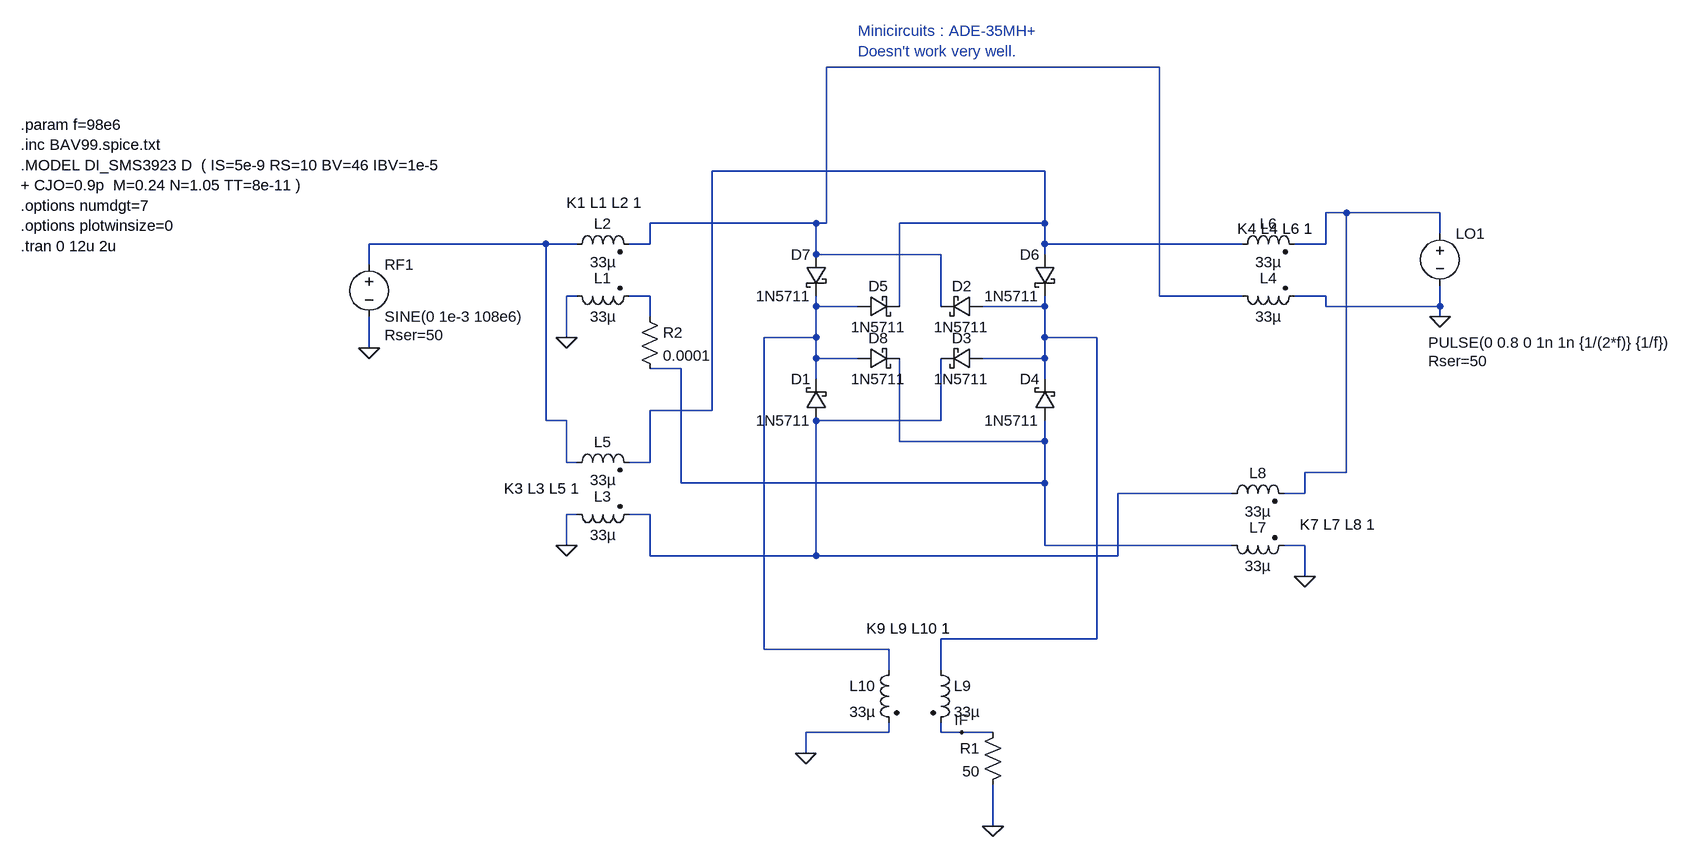
[diagram p0: schematic DDBM3.asc]
DDBM3.asc, the LTspice schematic file:
Version 4
SHEET 1 1816 884
WIRE 704 -304 192 -304
WIRE 528 -144 16 -144
WIRE 992 -80 960 -80
WIRE 1136 -80 992 -80
WIRE 176 -64 -80 -64
WIRE 192 -64 192 -304
WIRE 192 -64 176 -64
WIRE 528 -64 528 -144
WIRE 528 -64 304 -64
WIRE 1136 -48 1136 -80
WIRE -240 -32 -512 -32
WIRE -192 -32 -240 -32
WIRE -80 -32 -80 -64
WIRE -80 -32 -112 -32
WIRE 528 -32 528 -64
WIRE 832 -32 528 -32
WIRE 960 -32 960 -80
WIRE 960 -32 912 -32
WIRE 176 -16 176 -64
WIRE 368 -16 176 -16
WIRE 528 -16 528 -32
WIRE -512 0 -512 -32
WIRE -192 48 -208 48
WIRE -80 48 -112 48
WIRE 704 48 704 -304
WIRE 832 48 704 48
WIRE 960 48 912 48
WIRE 176 64 176 48
WIRE 240 64 176 64
WIRE 304 64 304 -64
WIRE 368 64 368 -16
WIRE 528 64 528 48
WIRE 528 64 432 64
WIRE 960 64 960 48
WIRE 1136 64 1136 32
WIRE 1136 64 960 64
WIRE -80 80 -80 48
WIRE 1136 80 1136 64
WIRE -208 112 -208 48
WIRE 176 112 176 64
WIRE 176 112 96 112
WIRE 528 112 528 64
WIRE 608 112 528 112
WIRE -512 128 -512 80
WIRE 176 144 176 112
WIRE 240 144 176 144
WIRE 528 144 528 112
WIRE 528 144 432 144
WIRE -32 160 -80 160
WIRE 176 176 176 144
WIRE 528 176 528 144
WIRE 16 224 16 -144
WIRE 16 224 -80 224
WIRE -240 240 -240 -32
WIRE -208 240 -240 240
WIRE 368 240 368 144
WIRE 368 240 176 240
WIRE 304 272 304 144
WIRE 528 272 528 240
WIRE 528 272 304 272
WIRE -208 304 -208 240
WIRE -192 304 -208 304
WIRE -80 304 -80 224
WIRE -80 304 -112 304
WIRE 992 320 992 -80
WIRE 992 320 928 320
WIRE -32 336 -32 160
WIRE 528 336 528 272
WIRE 528 336 -32 336
WIRE 816 352 640 352
WIRE 928 352 928 320
WIRE 928 352 896 352
WIRE -192 384 -208 384
WIRE -80 384 -112 384
WIRE -208 432 -208 384
WIRE 528 432 528 336
WIRE 816 432 528 432
WIRE 928 432 896 432
WIRE -80 448 -80 384
WIRE 176 448 176 240
WIRE 176 448 -80 448
WIRE 640 448 640 352
WIRE 640 448 176 448
WIRE 928 480 928 432
WIRE 608 576 608 112
WIRE 608 576 368 576
WIRE 96 592 96 112
WIRE 288 592 96 592
WIRE 288 624 288 592
WIRE 368 624 368 576
WIRE 288 720 288 704
WIRE 288 720 160 720
WIRE 368 720 368 704
WIRE 400 720 368 720
WIRE 448 720 400 720
WIRE 160 752 160 720
WIRE 448 864 448 800
FLAG -512 128 0
FLAG 1136 80 0
FLAG -208 112 0
FLAG -208 432 0
FLAG 160 752 0
FLAG 448 864 0
FLAG 928 480 0
FLAG 400 720 IF
SYMBOL voltage 1136 -64 R0
WINDOW 3 -18 184 Left 2
WINDOW 123 0 0 Left 0
WINDOW 39 -18 212 Left 2
SYMATTR Value PULSE(0 0.8 0 1n 1n {1/(2*f)} {1/f})
SYMATTR SpiceLine Rser=50
SYMATTR InstName LO1
SYMBOL ind2 -208 32 M90
WINDOW 0 4 56 VBottom 2
WINDOW 3 32 56 VTop 2
SYMATTR InstName L1
SYMATTR Value 33µ
SYMATTR Type ind
SYMATTR SpiceLine Rpar=0.0001
SYMBOL ind2 -208 -16 R270
WINDOW 0 32 56 VTop 2
WINDOW 3 4 56 VBottom 2
SYMATTR InstName L2
SYMATTR Value 33µ
SYMATTR Type ind
SYMBOL ind2 816 32 M90
WINDOW 0 4 56 VBottom 2
WINDOW 3 32 56 VTop 2
SYMATTR InstName L4
SYMATTR Value 33µ
SYMATTR Type ind
SYMATTR SpiceLine Rser=0.01
SYMBOL ind2 816 -16 R270
WINDOW 0 32 56 VTop 2
WINDOW 3 4 56 VBottom 2
SYMATTR InstName L6
SYMATTR Value 33µ
SYMATTR Type ind
SYMBOL schottky 192 240 R180
WINDOW 0 24 64 Left 2
WINDOW 3 24 0 Left 2
SYMATTR InstName D1
SYMATTR Value 1N5711
SYMATTR Description Diode
SYMATTR Type diode
SYMBOL voltage -512 -16 R0
WINDOW 123 0 0 Left 0
WINDOW 39 24 124 Left 2
SYMATTR SpiceLine Rser=50
SYMATTR InstName RF1
SYMATTR Value SINE(0 1e-3 108e6)
SYMBOL schottky 432 48 R90
WINDOW 0 0 32 VBottom 2
WINDOW 3 32 32 VTop 2
SYMATTR InstName D2
SYMATTR Value 1N5711
SYMATTR Description Diode
SYMATTR Type diode
SYMBOL schottky 432 128 R90
WINDOW 0 0 32 VBottom 2
WINDOW 3 32 32 VTop 2
SYMATTR InstName D3
SYMATTR Value 1N5711
SYMATTR Description Diode
SYMATTR Type diode
SYMBOL schottky 544 240 R180
WINDOW 0 24 64 Left 2
WINDOW 3 24 0 Left 2
SYMATTR InstName D4
SYMATTR Value 1N5711
SYMATTR Description Diode
SYMATTR Type diode
SYMBOL ind2 -208 368 M90
WINDOW 0 4 56 VBottom 2
WINDOW 3 32 56 VTop 2
SYMATTR InstName L3
SYMATTR Value 33µ
SYMATTR Type ind
SYMATTR SpiceLine Rser=0.0001
SYMBOL ind2 -208 320 R270
WINDOW 0 32 56 VTop 2
WINDOW 3 4 56 VBottom 2
SYMATTR InstName L5
SYMATTR Value 33µ
SYMATTR Type ind
SYMBOL ind2 800 416 M90
WINDOW 0 4 56 VBottom 2
WINDOW 3 32 56 VTop 2
SYMATTR InstName L7
SYMATTR Value 33µ
SYMATTR Type ind
SYMATTR SpiceLine Rpar=0.0001
SYMBOL ind2 800 368 R270
WINDOW 0 32 56 VTop 2
WINDOW 3 4 56 VBottom 2
SYMATTR InstName L8
SYMATTR Value 33µ
SYMATTR Type ind
SYMATTR SpiceLine Rser=0.01
SYMBOL schottky 240 48 M90
WINDOW 0 0 32 VBottom 2
WINDOW 3 32 32 VTop 2
SYMATTR InstName D5
SYMATTR Value 1N5711
SYMATTR Description Diode
SYMATTR Type diode
SYMBOL schottky 544 -16 M0
SYMATTR InstName D6
SYMATTR Value 1N5711
SYMATTR Description Diode
SYMATTR Type diode
SYMBOL schottky 192 -16 M0
SYMATTR InstName D7
SYMATTR Value 1N5711
SYMATTR Description Diode
SYMATTR Type diode
SYMBOL schottky 240 128 M90
WINDOW 0 0 32 VBottom 2
WINDOW 3 32 32 VTop 2
SYMATTR InstName D8
SYMATTR Value 1N5711
SYMATTR Description Diode
SYMATTR Type diode
SYMBOL ind2 352 608 R0
SYMATTR InstName L9
SYMATTR Value 33µ
SYMATTR Type ind
SYMBOL ind2 304 608 M0
SYMATTR InstName L10
SYMATTR Value 33µ
SYMATTR Type ind
SYMBOL res 464 704 M0
SYMATTR InstName R1
SYMATTR Value 50
SYMBOL res -96 64 R0
SYMATTR InstName R2
SYMATTR Value 0.0001
TEXT -208 -96 Left 2 !K1 L1 L2 1
TEXT -1048 -216 Left 2 !.param f=98e6\n.inc BAV99.spice.txt\n.MODEL DI_SMS3923 D  ( IS=5e-9 RS=10 BV=46 IBV=1e-5\n+ CJO=0.9p  M=0.24 N=1.05 TT=8e-11 )\n.options numdgt=7\n.options plotwinsize=0\n.tran 0 12u 2u
TEXT -304 344 Left 2 !K3 L3 L5 1
TEXT 824 -56 Left 2 !K4 L4 L6 1
TEXT 920 400 Left 2 !K7 L7 L8 1
TEXT 384 560 Right 2 !K9 L9 L10 1
TEXT 240 -360 Left 2 ;Minicircuits : ADE-35MH+\nDoesn't work very well.

The netlist it stands for:
* DDBM3.asc
V§LO1 N003 0 PULSE(0 0.8 0 1n 1n {1/(2*f)} {1/f}) Rser=50
L1 0 N005 33µ Rpar=0.0001
L2 N004 N001 33µ
L4 N001 0 33µ Rser=0.01
L6 N002 N003 33µ
D1 N009 N006 1N5711
V§RF1 N004 0 SINE(0 1e-3 108e6) Rser=50
D2 N007 N001 1N5711
D3 N007 N009 1N5711
D4 N008 N007 1N5711
L3 0 N009 33µ Rser=0.0001
L5 N004 N002 33µ
L7 N008 0 33µ Rpar=0.0001
L8 N009 N003 33µ Rser=0.01
D5 N006 N002 1N5711
D6 N002 N007 1N5711
D7 N001 N006 1N5711
D8 N006 N008 1N5711
L9 N007 IF 33µ
L10 N006 0 33µ
R1 IF 0 50
R2 N005 N008 0.0001
.model D D
.lib standard.dio
K1 L1 L2 1
.param f=98e6
.inc BAV99.spice.txt
.MODEL DI_SMS3923 D  ( IS=5e-9 RS=10 BV=46 IBV=1e-5
+ CJO=0.9p  M=0.24 N=1.05 TT=8e-11 )
.options numdgt=7
.options plotwinsize=0
.tran 0 12u 2u
K3 L3 L5 1
K4 L4 L6 1
K7 L7 L8 1
K9 L9 L10 1
* Minicircuits : ADE-35MH+
* Doesn't work very well.
.backanno
.end